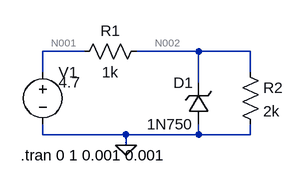
[diagram p0: schematic Draft6.asc]
Draft6.asc, the LTspice schematic file:
Version 4
SHEET 1 880 680
WIRE 144 112 80 112
WIRE 320 112 224 112
WIRE 400 112 320 112
WIRE 80 144 80 112
WIRE 400 144 400 112
WIRE 320 160 320 112
WIRE 80 240 80 224
WIRE 208 240 80 240
WIRE 320 240 320 224
WIRE 320 240 208 240
WIRE 400 240 400 224
WIRE 400 240 320 240
WIRE 208 256 208 240
FLAG 208 256 0
SYMBOL voltage 80 128 R0
WINDOW 3 24 31 Left 2
WINDOW 123 0 0 Left 0
WINDOW 39 0 0 Left 0
SYMATTR InstName V1
SYMATTR Value 4.7
SYMBOL res 240 96 R90
WINDOW 0 0 56 VBottom 2
WINDOW 3 32 56 VTop 2
SYMATTR InstName R1
SYMATTR Value 1k
SYMBOL zener 336 224 R180
WINDOW 0 24 64 Left 2
WINDOW 3 24 0 Left 2
SYMATTR InstName D1
SYMATTR Value 1N750
SYMBOL res 384 128 R0
SYMATTR InstName R2
SYMATTR Value 2k
TEXT 46 272 Left 2 !.tran 0 1 0.001 0.001

The netlist it stands for:
* Draft6.asc
V1 N001 0 4.7
R1 N002 N001 1k
D1 0 N002 1N750
R2 N002 0 2k
.model D D
.lib standard.dio
.tran 0 1 0.001 0.001
.backanno
.end

* Results of the author's LTspice run, read from the files saved beside the schematic
* Operating Point, zero values left out:
*   V(n001) = 4.7 V
*   V(n002) = 3.112 V
*   I(D1) = -32.66 µA
*   I(R2) = 1.556 mA
*   I(R1) = -1.588 mA
*   I(V1) = -1.588 mA